# EAGLE schematic step_down_v_reg (EAGLE 7.2.0)
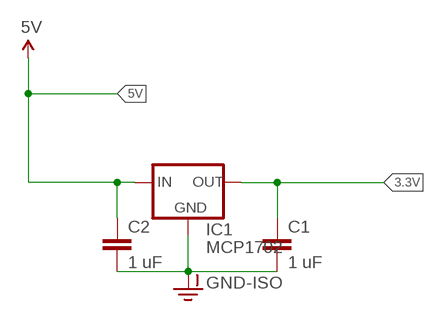
[diagram p0: schematic, sheet 1]

## Parts
C1  1 uF  CAPPTH  [CAP-PTH-SMALL]
C2  1 uF  CAPPTH  [CAP-PTH-SMALL]
IC1  MCP1702  MCP1700TRI  [TO92]

## Nets
3.3V: C1.1 IC1.3(OUT)
5V: C2.1 IC1.2(IN)
GND-ISO: C1.2 C2.2 IC1.1(GND)

## Library data of the parts
C1 C2 = SparkFun-Capacitors:CAP: Capacitor Standard 0603 ceramic capacitor, and 0.1" leaded capacitor.
IC1 = adafruit:MCP1700: VOLTAGE REGULATOR